# EAGLE schematic zenith (EAGLE 9.6.2)
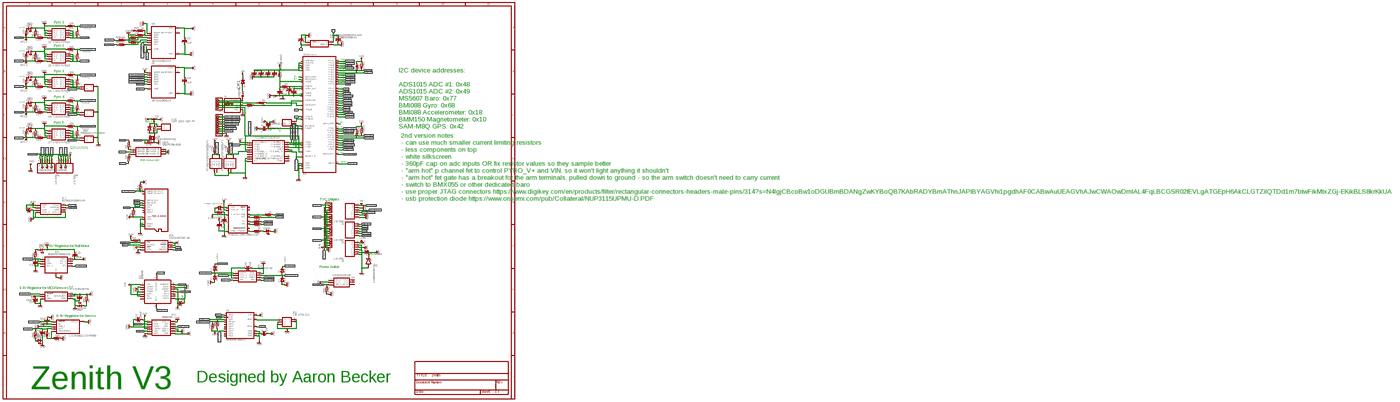
[diagram p0: schematic, sheet 1, overview]
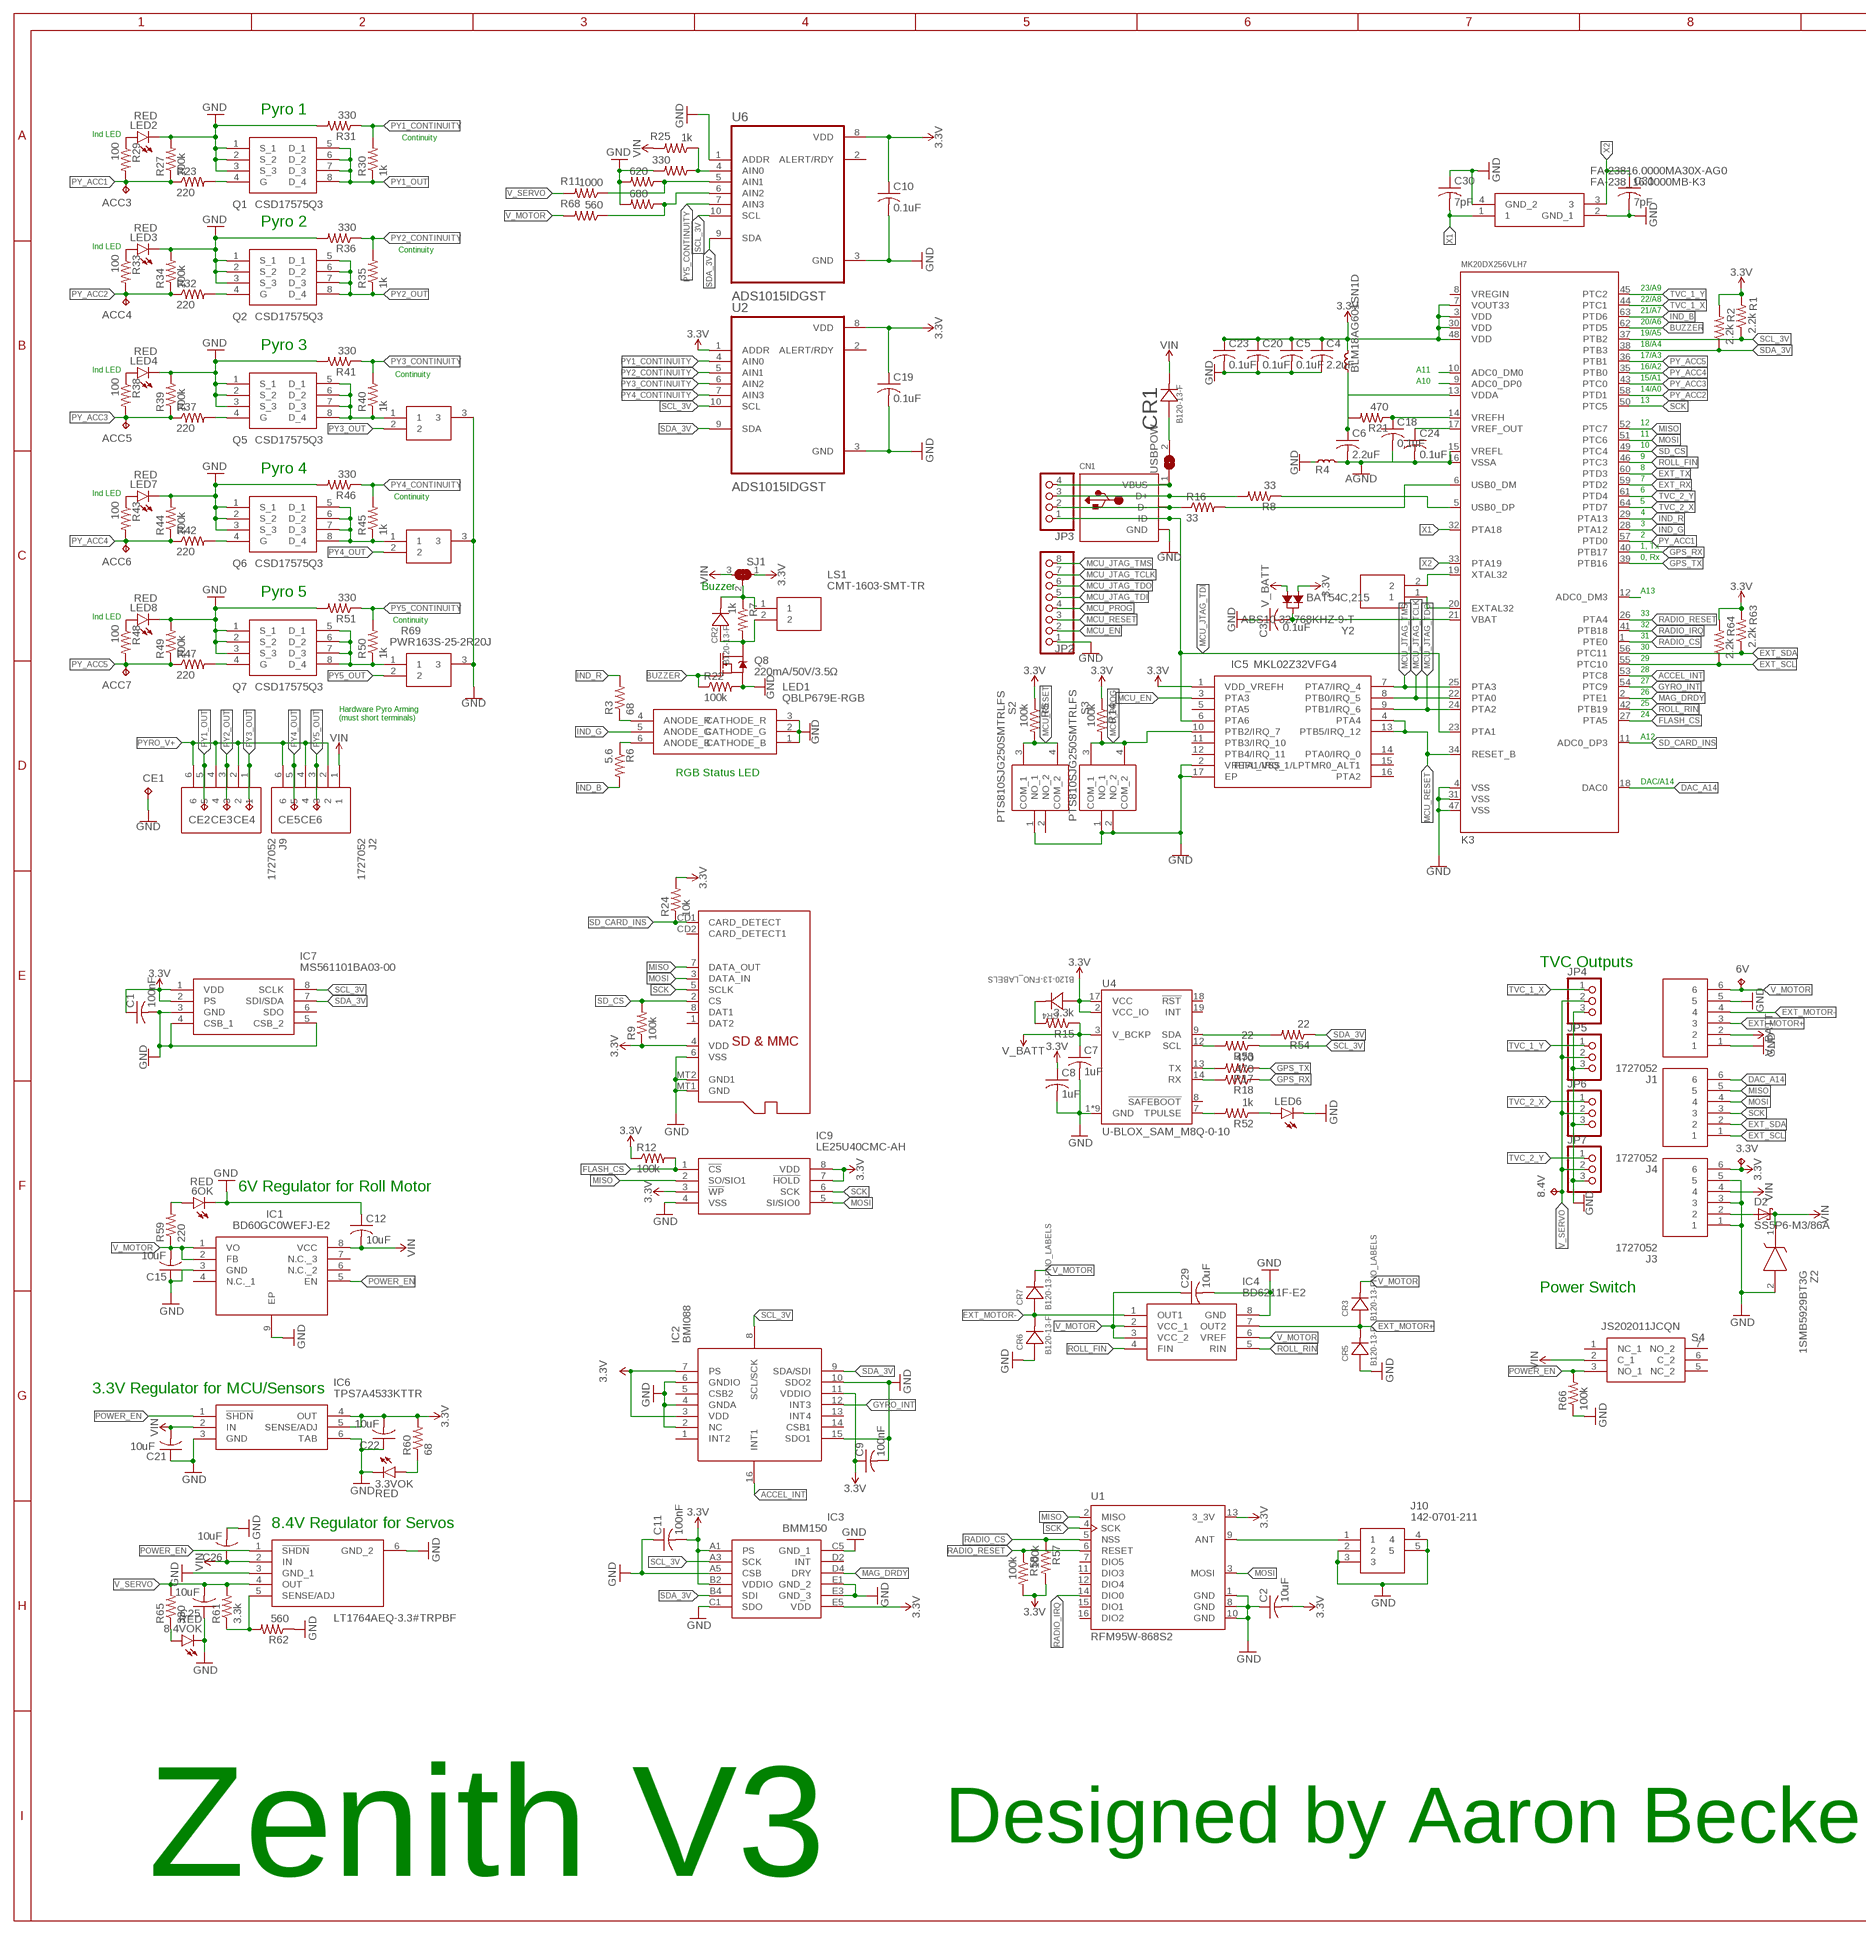
[diagram p1: schematic, sheet 1, part 1 of 4]
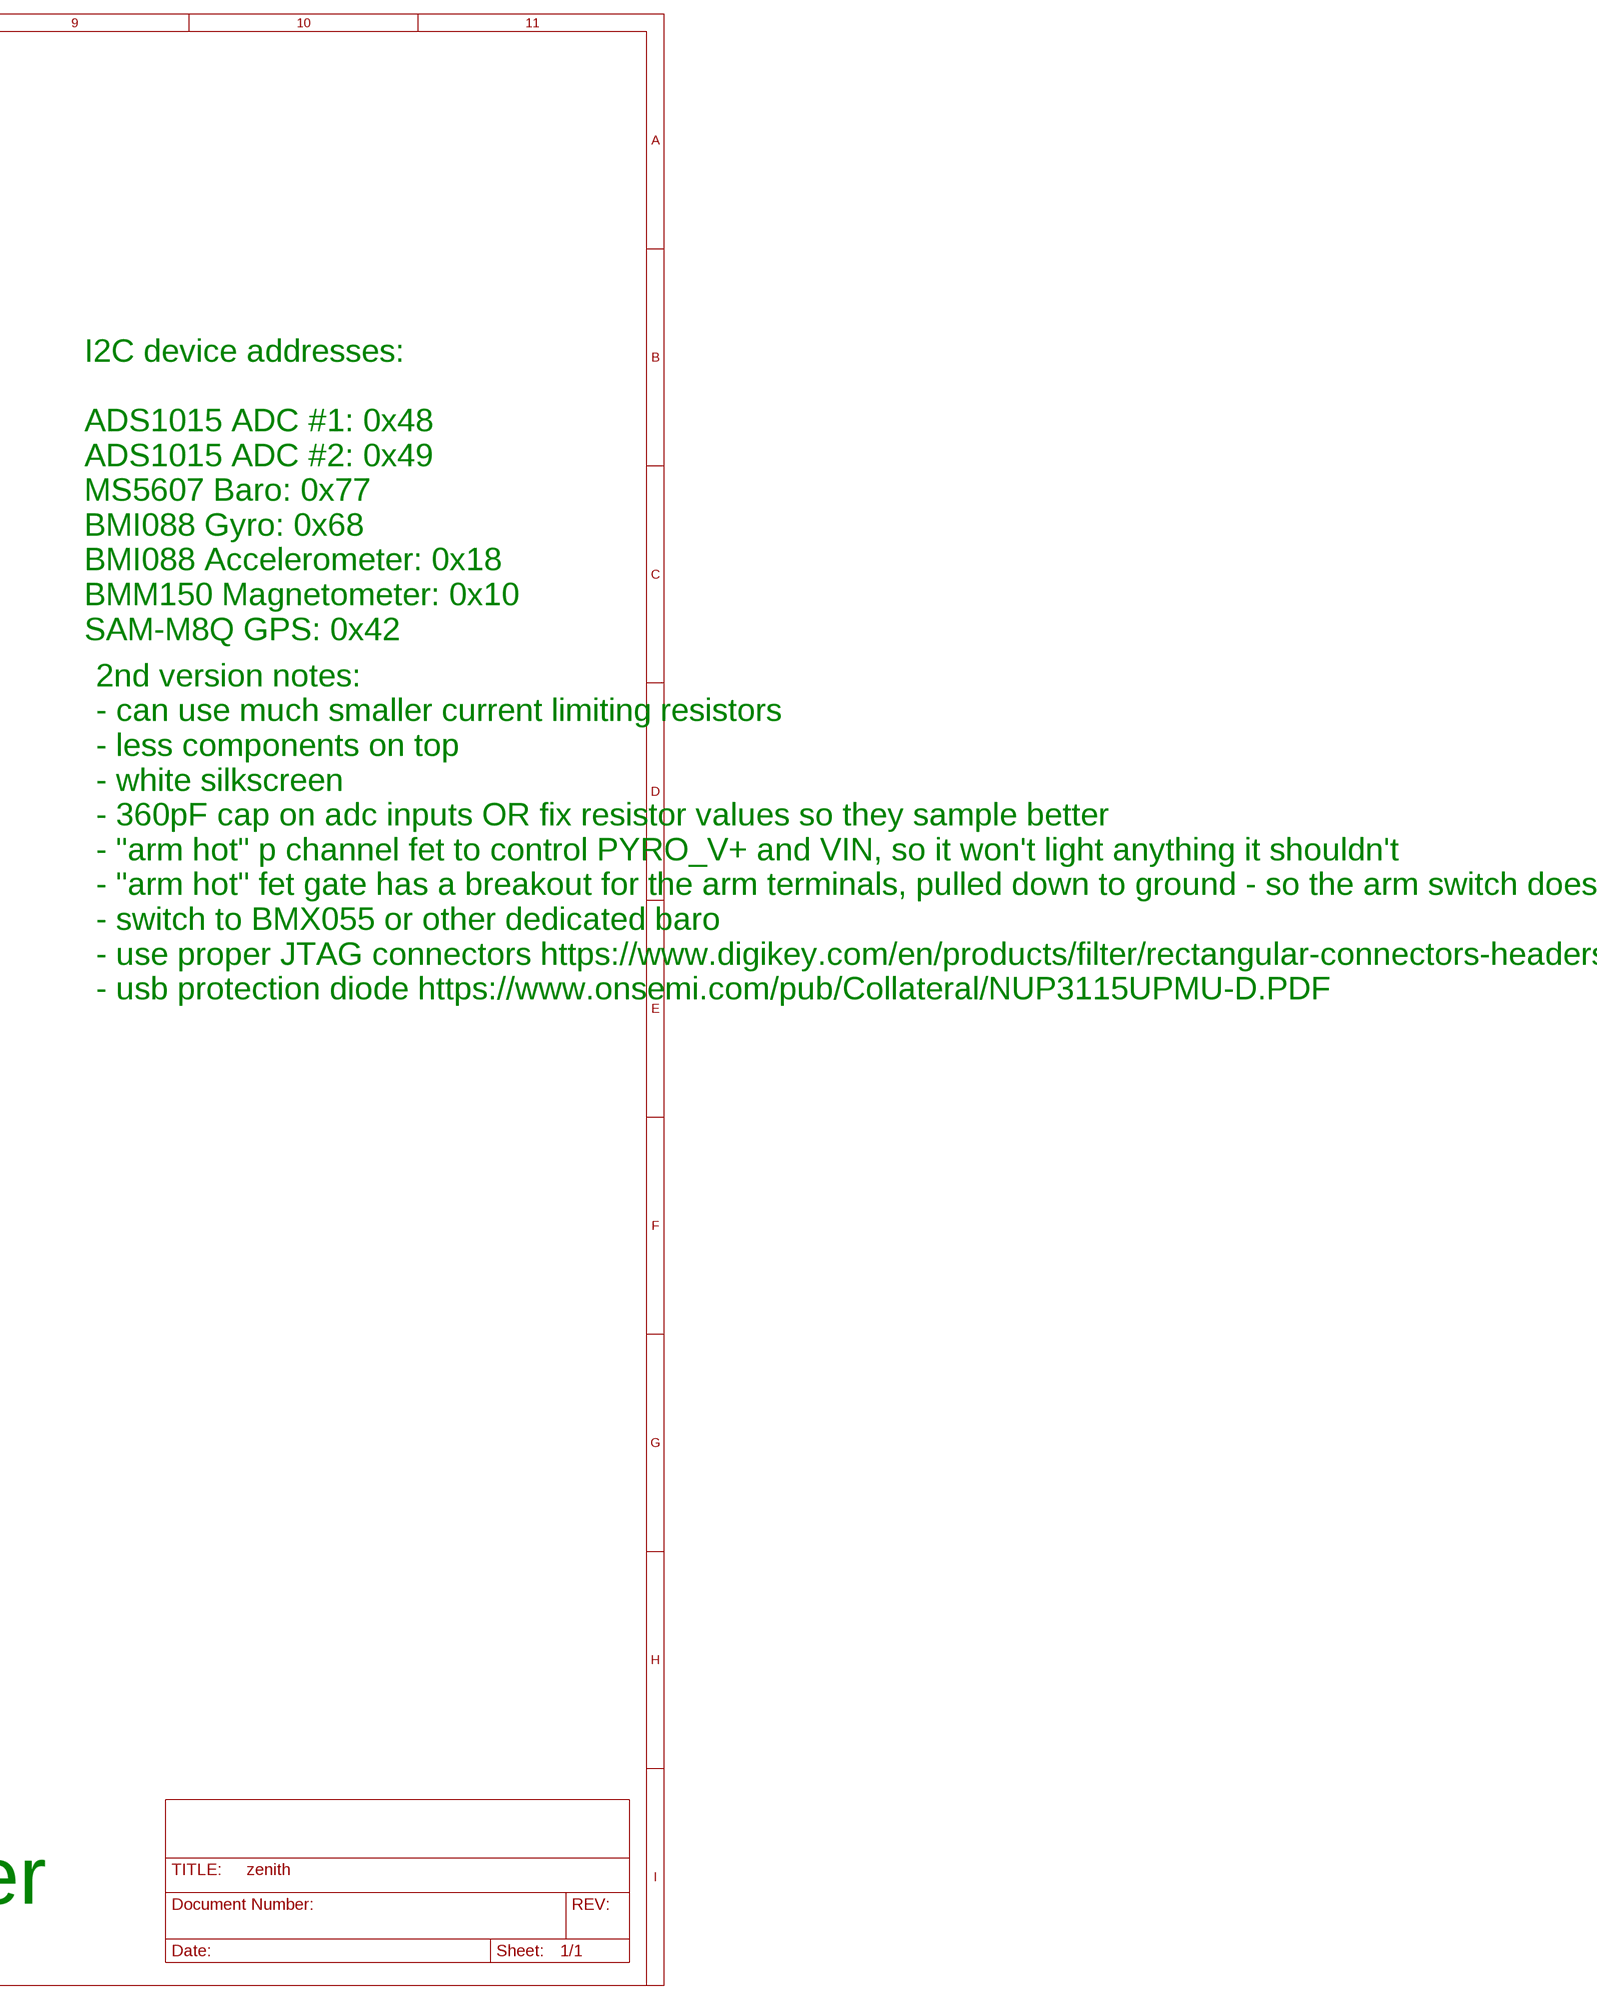
[diagram p2: schematic, sheet 1, part 2 of 4]
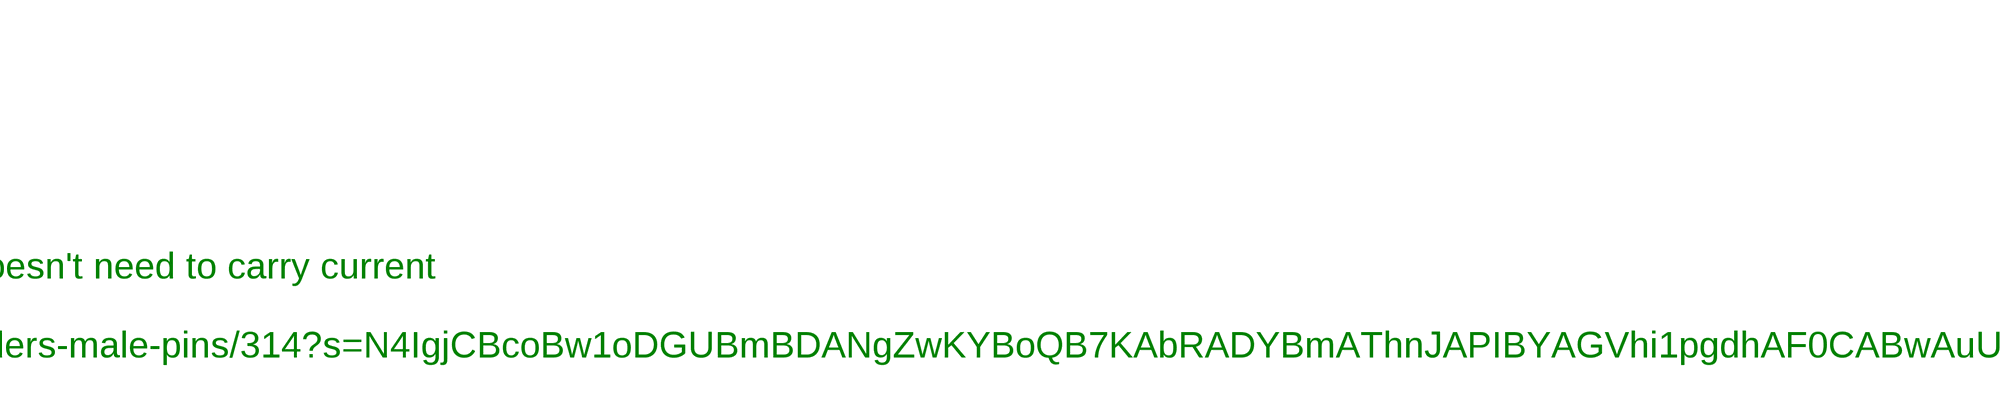
[diagram p3: schematic, sheet 1, part 3 of 4]
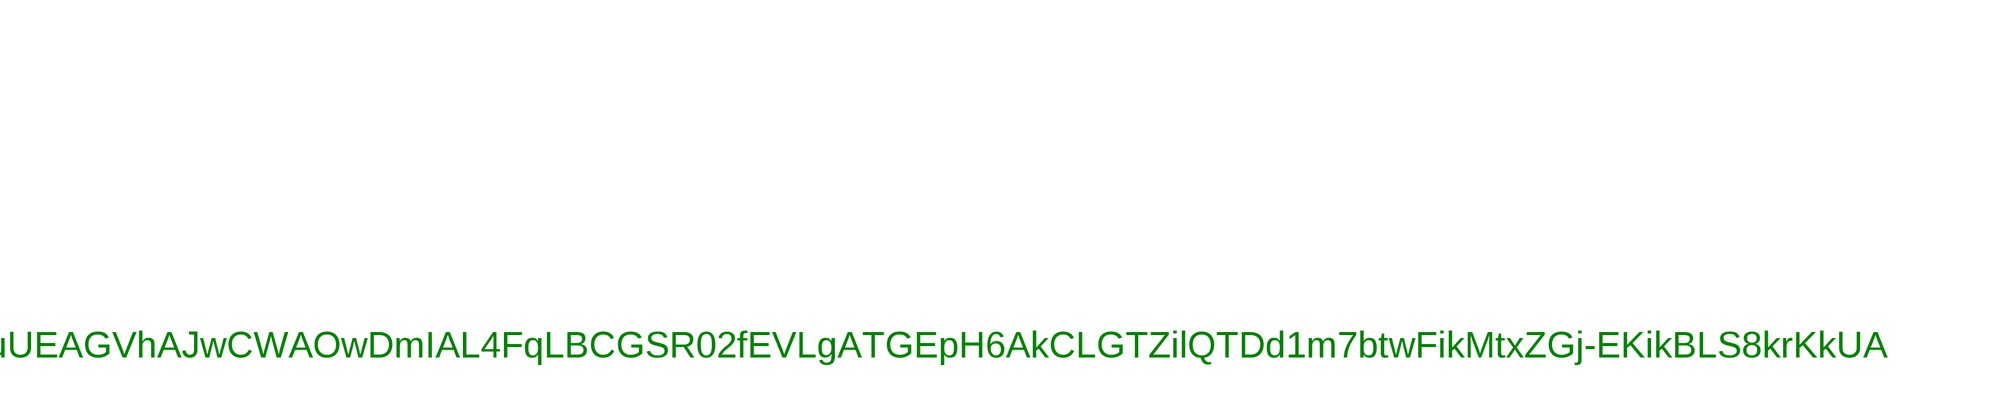
[diagram p4: schematic, sheet 1, part 4 of 4]

## Parts
3.3V  TPB1,27  [B1,27]
3.3VOK  RED  LEDCHIP-LED0805  [CHIP-LED0805]
6OK  RED  LEDCHIP-LED0805  [CHIP-LED0805]
6V  TPB1,27  [B1,27]
8.4V  TPB1,27  [B1,27]
8.4VOK  RED  LEDCHIP-LED0805  [CHIP-LED0805]
0473340001  MICROSD  [MICROSD]
ACC3  TPB1,27  [B1,27]
ACC4  TPB1,27  [B1,27]
ACC5  TPB1,27  [B1,27]
ACC6  TPB1,27  [B1,27]
ACC7  TPB1,27  [B1,27]
BAT54C,215  DIODE_DUAL  [SOT-23]
BLM18AG601SN1D  FERRITE  [L0603]
C1  100nF  C-USC0603  [C0603]
C2  10uF  C-USC0603  [C0603]
C3  0.1uF  C-USC0603  [C0603]
C4  2.2uF  C-USC0603  [C0603]
C5  0.1uF  C-USC0603  [C0603]
C6  2.2uF  C-USC0603  [C0603]
C7  1uF  C-USC0603  [C0603]
C8  1uF  C-USC0603  [C0603]
C9  100nF  C-USC0603  [C0603]
C10  0.1uF  C-USC0603  [C0603]
C11  100nF  C-USC0603  [C0603]
C12  10uF  C-USC0603  [C0603]
C15  10uF  C-USC0603  [C0603]
C18  0.1uF  C-USC0603  [C0603]
C19  0.1uF  C-USC0603  [C0603]
C20  0.1uF  C-USC0603  [C0603]
C21  10uF  C-USC0603  [C0603]
C22  10uF  C-USC0603  [C0603]
C23  0.1uF  C-USC0603  [C0603]
C24  0.1uF  C-USC0603  [C0603]
C25  10uF  C-USC0603  [C0603]
C26  10uF  C-USC0603  [C0603]
C29  10uF  C-USC0603  [C0603]
C30  7pF  C-USC0603  [C0603]
C31  7pF  C-USC0603  [C0603]
CE1  TPB1,27  [B1,27]
CE2  TPB1,27  [B1,27]
CE3  TPB1,27  [B1,27]
CE4  TPB1,27  [B1,27]
CE5  TPB1,27  [B1,27]
CE6  TPB1,27  [B1,27]
CN1  USBMINIB  [USB-MINIB]
CR1  B120-13-F  [SMA_DIO]
CR2  B120-13-F  [SMA_DIO]
CR3  B120-13-FNO_LABELS  [SMA_NO_LABELS]
CR4  B120-13-FNO_LABELS  [SMA_NO_LABELS]
CR5  B120-13-F  [SMA_DIO]
CR6  B120-13-F  [SMA_DIO]
CR7  B120-13-FNO_LABELS  [SMA_NO_LABELS]
D2  SS5P6-M3/86A  [TO-277A(SMPC)]
FA-23816.0000MA30X-AG0  FA-238_16.0000MB-K3  [EPSON-FA-238]
IC1  BD60GC0WEFJ-E2  [SOIC127P600X100-9N]
IC2  BMI088  [BMI088]
IC3  BMM150  [BMM150]
IC4  BD6211F-E2  [SOIC127P620X171-8N]
IC5  MKL02Z32VFG4  [QFN50P300X300X65-17N]
IC6  TPS7A4533KTTR  [KTT0005B]
IC7  MS561101BA03-00  [SON125P300X500X100-8N]
IC9  LE25U40CMC-AH  [SOIC127P600X175-8N]
J1  1727052  [SHDR6W105P0X381_1X6_2285X730X8]
J2  1727052  [SHDR6W105P0X381_1X6_2285X730X8]
J3  1727052  [SHDR6W105P0X381_1X6_2285X730X8]
J4  1727052  [SHDR6W105P0X381_1X6_2285X730X8]
J9  1727052  [SHDR6W105P0X381_1X6_2285X730X8]
J10  142-0701-211  [1420701211]
JP2  PINHD-1X8  [1X08]
JP3  PINHD-1X4  [1X04]
JP4  PINHD-1X3  [1X03]
JP5  PINHD-1X3  [1X03]
JP6  PINHD-1X3  [1X03]
JP7  PINHD-1X3  [1X03]
K3  MK20DX256VLH7  [LQFP64-05]
LED1  QBLP679E-RGB  [QBLP679ERGB]
LED2  RED  LEDCHIP-LED0805  [CHIP-LED0805]
LED3  RED  LEDCHIP-LED0805  [CHIP-LED0805]
LED4  RED  LEDCHIP-LED0805  [CHIP-LED0805]
LED6  LEDCHIP-LED0805  [CHIP-LED0805]
LED7  RED  LEDCHIP-LED0805  [CHIP-LED0805]
LED8  RED  LEDCHIP-LED0805  [CHIP-LED0805]
LS1  CMT-1603-SMT-TR  [CMT1603SMTTR]
LT1764#TRPBF  LT1764AEQ-3.3#TRPBF  [LT1764AEQ33TRPBF]
Q1  CSD17575Q3  [CSD16327]
Q2  CSD17575Q3  [CSD16327]
Q5  CSD17575Q3  [CSD16327]
Q6  CSD17575Q3  [CSD16327]
Q7  CSD17575Q3  [CSD16327]
Q8  220mA/50V/3.5Ω  MOSFET-NCH-BSS138  [SOT23-3]
R1  2.2k  R-US_R0603  [R0603]
R2  2.2k  R-US_R0603  [R0603]
R3  68  R-US_R0603  [R0603]
R4  FERRITE  [L0603]
R5  100k  R-US_R0603  [R0603]
R6  5.6  R-US_R0603  [R0603]
R7  1k  R-US_R0603  [R0603]
R8  33  R-US_R0603  [R0603]
R9  100k  R-US_R0603  [R0603]
R10  620  R-US_R0603  [R0603]
R11  1000  R-US_R0603  [R0603]
R12  100k  R-US_R0603  [R0603]
R14  100k  R-US_R0603  [R0603]
R15  3.3k  R-US_R0603  [R0603]
R16  33  R-US_R0603  [R0603]
R17  470  R-US_R0603  [R0603]
R18  470  R-US_R0603  [R0603]
R21  470  R-US_R0603  [R0603]
R22  100k  R-US_R0603  [R0603]
R23  220  R-US_R0603  [R0603]
R24  10k  R-US_R0603  [R0603]
R25  1k  R-US_R0603  [R0603]
R26  330  R-US_R0603  [R0603]
R27  100k  R-US_R0603  [R0603]
R28  PWR163S-25-2R20J  [PWR163_DPAK]
R29  100  R-US_R0603  [R0603]
R30  1k  R-US_R0603  [R0603]
R31  330  R-US_R0603  [R0603]
R32  220  R-US_R0603  [R0603]
R33  100  R-US_R0603  [R0603]
R34  100k  R-US_R0603  [R0603]
R35  1k  R-US_R0603  [R0603]
R36  330  R-US_R0603  [R0603]
R37  220  R-US_R0603  [R0603]
R38  100  R-US_R0603  [R0603]
R39  100k  R-US_R0603  [R0603]
R40  1k  R-US_R0603  [R0603]
R41  330  R-US_R0603  [R0603]
R42  220  R-US_R0603  [R0603]
R43  100  R-US_R0603  [R0603]
R44  100k  R-US_R0603  [R0603]
R45  1k  R-US_R0603  [R0603]
R46  330  R-US_R0603  [R0603]
R47  220  R-US_R0603  [R0603]
R48  100  R-US_R0603  [R0603]
R49  100k  R-US_R0603  [R0603]
R50  1k  R-US_R0603  [R0603]
R51  330  R-US_R0603  [R0603]
R52  1k  R-US_R0603  [R0603]
R53  22  R-US_R0603  [R0603]
R54  22  R-US_R0603  [R0603]
R55  PWR163S-25-2R20J  [PWR163_DPAK]
R57  100k  R-US_R0603  [R0603]
R58  100k  R-US_R0603  [R0603]
R59  220  R-US_R0603  [R0603]
R60  68  R-US_R0603  [R0603]
R61  3.3k  R-US_R0603  [R0603]
R62  560  R-US_R0603  [R0603]
R63  2.2k  R-US_R0603  [R0603]
R64  2.2k  R-US_R0603  [R0603]
R65  330  R-US_R0603  [R0603]
R66  100k  R-US_R0603  [R0603]
R67  680  R-US_R0603  [R0603]
R68  560  R-US_R0603  [R0603]
R69  PWR163S-25-2R20J  [PWR163_DPAK]
S2  PTS810SJG250SMTRLFS  [PTS810SJG250SMTRLFS]
S3  PTS810SJG250SMTRLFS  [PTS810SJG250SMTRLFS]
S4  JS202011JCQN  [JS202011JCQN]
SJ1  SOLDERJUMPER_2WAY0603  [SOLDERJUMPER_2WAY_OPEN_0603]
U1  RFM95W-868S2  [XCVR_RFM95W-868S2]
U2  ADS1015IDGST  [SOP50P490X110-10N]
U4  U-BLOX_SAM_M8Q-0-10  [SAM-M8Q]
U6  ADS1015IDGST  [SOP50P490X110-10N]
USBPOW  SJ  [SJ]
Y2  ABS10-32.768KHZ-9-T  [ABS-10]
Z2  1SMB5929BT3G  [DIOM5436X247N]

## Nets
3.3V [ICPower]: 3.3V.TP 0473340001.4(VDD) BAT54C,215.1 BLM18AG601SN1D.2 C1.1 C2.2 C4.1 C5.1 C8.1 C9.1 C10.1 C11.2 C19.1 C20.1 C22.2 C23.1 CR4.2 IC2.3(VDD) IC2.7(PS) IC2.11(VDDIO) IC3.A1(PS) IC3.B2(VDDIO) IC3.E5(VDD) IC5.1(VDD_VREFH) IC6.4(OUT) IC6.5(SENSE/ADJ) IC7.1(VDD) IC7.2(PS) IC9.3(!WP) IC9.7(!HOLD) IC9.8(VDD) J3.6 K3.3(VDD) K3.7(VOUT33) K3.30(VDD) K3.48(VDD) R1.2 R2.2 R5.1 R9.1 R12.1 R14.1 R24.2 R57.2 R58.2 R60.2 R63.2 R64.2 SJ1.1 U1.13(3_3V) U2.1(ADDR) U2.8(VDD) U4.2(VCC_IO) U4.17(VCC) U6.8(VDD)
ACCEL_INT: IC2.16(INT1) K3.53(PTC8)
AGND: C6.2 C18.2 C24.2 K3.15(VREFL) K3.16(VSSA) R4.2
BUZZER: K3.62(PTD5) Q8.1(G) R22.1
DAC_A14: J4.6 K3.18(DAC0)
EXT_MOTOR+ [ICPower]: CR3.2 CR5.1 IC4.7(OUT2) J1.3
EXT_MOTOR- [ICPower]: CR6.1 CR7.2 IC4.1(OUT1) J1.4
EXT_RX: K3.59(PTD2)
EXT_SCL: J4.1 K3.55(PTC10) R64.1
EXT_SDA: J4.2 K3.56(PTC11) R63.1
EXT_TX: K3.60(PTD3)
FLASH_CS: IC9.1(!CS) K3.27(PTA5) R12.2
GND [ICPower]: 3.3VOK.C 6OK.C 8.4VOK.C 0473340001.6(VSS) 0473340001.MT1(GND) 0473340001.MT2(GND1) C1.2 C2.1 C3.1 C4.2 C5.2 C7.2 C8.2 C9.2 C10.2 C11.1 C12.1 C15.1 C19.2 C20.2 C21.1 C22.1 C23.2 C25.1 C26.2 C29.2 C30.1 C31.2 CE1.TP CN1.GND CR5.2 CR6.2 FA-23816.0000MA30X-AG0.2(GND_1) FA-23816.0000MA30X-AG0.4(GND_2) IC1.3(GND) IC1.9(EP) IC2.2(NC) IC2.4(GNDA) IC2.6(GNDIO) IC2.10(SDO2) IC2.15(SDO1) IC3.A5(CSB) IC3.C1(SDO) IC3.C5(GND_1) IC3.E1(GND_2) IC3.E3(GND_3) IC4.8(GND) IC5.2(VREFL_VSS) IC5.17(EP) IC6.3(GND) IC6.6(TAB) IC7.3(GND) IC7.4(CSB_1) IC7.5(CSB_2) IC9.4(VSS) J1.1 J1.5 J3.1 J3.3 J3.5 J10.2 J10.3 J10.4 J10.5 JP2.1 JP4.3 JP5.3 JP6.3 JP7.3 K3.4(VSS) K3.31(VSS) K3.47(VSS) LED1.1(CATHODE_B) LED1.2(CATHODE_G) LED1.3(CATHODE_R) LED2.C LED3.C LED4.C LED6.C LED7.C LED8.C LT1764#TRPBF.3(GND_1) LT1764#TRPBF.6(GND_2) Q1.1(S_1) Q1.2(S_2) Q1.3(S_3) Q2.1(S_1) Q2.2(S_2) Q2.3(S_3) Q5.1(S_1) Q5.2(S_2) Q5.3(S_3) Q6.1(S_1) Q6.2(S_2) Q6.3(S_3) Q7.1(S_1) Q7.2(S_2) Q7.3(S_3) Q8.2(S) R4.1 R10.2 R22.2 R26.2 R27.2 R28.3 R31.2 R34.2 R36.2 R39.2 R41.2 R44.2 R46.2 R49.2 R51.2 R55.3 R62.1 R66.1 R67.2 R69.3 S2.1(NO_1) S3.1(NO_1) S3.2(NO_2) U1.1(GND) U1.8(GND) U1.10(GND) U2.3(GND) U4.1(GND) U4.4(GND) U4.5(GND) U4.6(GND) U4.10(GND) U4.11(GND) U4.15(GND) U4.16(GND) U4.20(GND) U6.1(ADDR) U6.3(GND) Z2.2(A)
GPS_RX: K3.40(PTB17) R18.1
GPS_TX: K3.39(PTB16) R17.1
GYRO_INT: IC2.12(INT3) K3.54(PTC9)
IND_B [SemiHighPower]: K3.63(PTD6) R6.2
IND_G [SemiHighPower]: K3.28(PTA12) LED1.5(ANODE_G)
IND_R [SemiHighPower]: K3.29(PTA13) R3.2
MAG_DRDY: IC3.D4(DRY) K3.2(PTE1)
MCU_EN: IC5.3(PTA3) JP2.2
MCU_JTAG_TCLK: IC5.8(PTB0/IRQ_5) JP2.7 K3.22(PTA0)
MCU_JTAG_TDI: CN1.ID IC5.6(PTA6) JP2.5 JP3.1 K3.23(PTA1)
MCU_JTAG_TDO: IC5.9(PTB1/IRQ_6) JP2.6 K3.24(PTA2)
MCU_JTAG_TMS: IC5.7(PTA7/IRQ_4) JP2.8 K3.25(PTA3)
MCU_PROG: IC5.10(PTB2/IRQ_7) JP2.4 R14.2 S3.3(COM_1) S3.4(COM_2)
MCU_RESET: IC5.4(PTA4) IC5.13(PTB5/IRQ_12) JP2.3 K3.34(RESET_B) R5.2 S2.3(COM_1) S2.4(COM_2)
MISO: 0473340001.7(DATA_OUT) IC9.2(SO/SIO1) J4.5 K3.52(PTC7) U1.2(MISO)
MOSI: 0473340001.3(DATA_IN) IC9.5(SI/SIO0) J4.4 K3.51(PTC6) U1.3(MOSI)
N$1: BAT54C,215.3 C3.2 K3.21(VBAT)
N$2 [SemiHighPower]: LED1.4(ANODE_R) R3.1
N$3: K3.19(XTAL32) Y2.2
N$4: BLM18AG601SN1D.1 C6.1 R21.2
N$5: R10.1 R11.1 U6.5(AIN1)
N$6 [SemiHighPower]: LED1.6(ANODE_B) R6.1
N$7: CR2.2 LS1.2 Q8.3(D) R7.2
N$8: J10.1 U1.9(ANT)
N$9 [Pyro]: Q7.5(D_1) Q7.6(D_2) Q7.7(D_3) Q7.8(D_4) R50.1 R69.1
N$10: C24.1 K3.17(VREF_OUT)
N$11: 3.3VOK.A R60.1
N$12: CR4.1 R15.2
N$14: 6OK.A R59.2
N$15: R17.2 U4.13(TX)
N$16: R18.2 U4.14(RX)
N$17: LED6.A R52.1
N$18: R52.2 U4.7(TPULSE)
N$19: 8.4VOK.A R65.1
N$20: R25.1 R26.1 U6.4(AIN0)
N$21: CN1.D+ JP3.3 R8.2
N$22: CN1.D- JP3.2 R16.1
N$23: K3.5(USB0_DP) R8.1
N$24: K3.6(USB0_DM) R16.2
N$25: CR1.2 USBPOW.2
N$26 [Pyro]: Q6.5(D_1) Q6.6(D_2) Q6.7(D_3) Q6.8(D_4) R28.1 R45.1
N$27: CN1.VBUS JP3.4 USBPOW.1
N$29: K3.13(VDDA)
N$30: C18.1 K3.14(VREFH) R21.1
N$31: R54.2 U4.9(SDA)
N$32: R53.2 U4.12(SCL)
N$33: LT1764#TRPBF.5(SENSE/ADJ) R61.1 R62.2
N$34: R67.1 R68.1 U6.6(AIN2)
N$35: CR2.1 LS1.1 R7.1 SJ1.2
N$36 [Pyro]: D2.A1(A) D2.A2(A) J3.2
N$37: K3.20(EXTAL32) Y2.1
N$39 [Pyro]: Q5.5(D_1) Q5.6(D_2) Q5.7(D_3) Q5.8(D_4) R40.1 R55.1
N$81: Q1.4(G) R23.2
N$82: LED2.A R29.1
N$86: Q2.4(G) R32.2
N$88: LED3.A R33.1
N$92: Q5.4(G) R37.2
N$94: LED4.A R38.1
N$98: Q6.4(G) R42.2
N$100: LED7.A R43.1
N$104: Q7.4(G) R47.2
N$106: LED8.A R48.1
N$117: K3.12(ADC0_DM3)
N$129: K3.10(ADC0_DM0)
N$130: K3.9(ADC0_DP0)
POWER_EN: IC1.5(EN) IC6.1(!SHDN) LT1764#TRPBF.1(!SHDN) R66.2 S4.3(NO_1)
PY1_CONTINUITY: R30.2 R31.1 U2.4(AIN0)
PY1_OUT [Pyro]: CE2.TP J9.5 Q1.5(D_1) Q1.6(D_2) Q1.7(D_3) Q1.8(D_4) R30.1
PY2_CONTINUITY: R35.2 R36.1 U2.5(AIN1)
PY2_OUT [Pyro]: CE3.TP J9.3 Q2.5(D_1) Q2.6(D_2) Q2.7(D_3) Q2.8(D_4) R35.1
PY3_CONTINUITY: R40.2 R41.1 U2.6(AIN2)
PY3_OUT [Pyro]: CE4.TP J9.1 R55.2
PY4_CONTINUITY: R45.2 R46.1 U2.7(AIN3)
PY4_OUT [Pyro]: CE5.TP J2.5 R28.2
PY5_CONTINUITY: R50.2 R51.1 U6.7(AIN3)
PY5_OUT [Pyro]: CE6.TP J2.3 R69.2
PY_ACC1: ACC3.TP K3.57(PTD0) R23.1 R27.1 R29.2
PY_ACC2: ACC4.TP K3.58(PTD1) R32.1 R33.2 R34.1
PY_ACC3: ACC5.TP K3.43(PTC0) R37.1 R38.2 R39.1
PY_ACC4: ACC6.TP K3.35(PTB0) R42.1 R43.2 R44.1
PY_ACC5: ACC7.TP K3.36(PTB1) R47.1 R48.2 R49.1
PYRO_V+ [Pyro]: J2.2 J2.4 J2.6 J9.2 J9.4 J9.6
RADIO_CS: K3.1(PTE0) R57.1 U1.5(NSS)
RADIO_IRQ: K3.41(PTB18) U1.14(DIO0)
RADIO_RESET: K3.26(PTA4) R58.1 U1.6(RESET)
ROLL_FIN: IC4.4(FIN) K3.46(PTC3)
ROLL_RIN: IC4.5(RIN) K3.42(PTB19)
SCK: 0473340001.5(SCLK) IC9.6(SCK) J4.3 K3.50(PTC5) U1.4(SCK)
SCL_3V: IC2.8(SCL/SCK) IC3.A3(SCK) IC7.8(SCLK) K3.37(PTB2) R1.1 R53.1 U2.10(SCL) U6.10(SCL)
SD_CARD_INS: 0473340001.CD1(CARD_DETECT) K3.11(ADC0_DP3) R24.1
SD_CS: 0473340001.2(CS) K3.49(PTC4) R9.2
SDA_3V: IC2.9(SDA/SDI) IC3.B4(SDI) IC7.7(SDI/SDA) K3.38(PTB3) R2.1 R54.1 U2.9(SDA) U6.9(SDA)
TVC_1_X: JP4.1 K3.44(PTC1)
TVC_1_Y: JP5.1 K3.45(PTC2)
TVC_2_X: JP6.1 K3.64(PTD7)
TVC_2_Y: JP7.1 K3.61(PTD4)
V_BATT: BAT54C,215.2 C7.1 J1.2 R15.1 U4.3(V_BCKP)
V_MOTOR [HighPower]: 6V.TP C15.2 C29.1 CR3.1 CR7.1 IC1.1(VO) IC1.2(FB) IC4.2(VCC_1) IC4.3(VCC_2) IC4.6(VREF) J1.6 R59.1 R68.2
V_SERVO [HighPower]: 8.4V.TP C25.2 JP4.2 JP5.2 JP6.2 JP7.2 LT1764#TRPBF.4(OUT) R11.2 R61.2 R65.2
VIN [Pyro]: C12.2 C21.2 C26.1 CR1.1 D2.K(C) IC1.8(VCC) IC6.2(IN) J2.1 J3.4 LT1764#TRPBF.2(IN) R25.2 S4.2(C_1) SJ1.3 Z2.1(K)
X1: C30.2 FA-23816.0000MA30X-AG0.1 K3.32(PTA18)
X2: C31.1 FA-23816.0000MA30X-AG0.3 K3.33(PTA19)
Unconnected: 0473340001.1(DAT2) 0473340001.8(DAT1) 0473340001.CD2(CARD_DETECT1) IC1.4(N.C._1) IC1.6(N.C._2) IC1.7(N.C._3) IC2.1(INT2) IC2.5(CSB2) IC2.13(INT4) IC2.14(CSB1) IC3.D2(INT) IC5.5(PTA5) IC5.11(PTB3/IRQ_10) IC5.12(PTB4/IRQ_11) IC5.14(PTA0/IRQ_0) IC5.15(PTA1/IRQ_1/LPTMR0_ALT1) IC5.16(PTA2) IC7.6(SDO) K3.8(VREGIN) S2.2(NO_2) S4.1(NC_1) S4.5(NC_2) S4.6(C_2) S4.7(NO_2) U1.7(DIO5) U1.11(DIO3) U1.12(DIO4) U1.15(DIO1) U1.16(DIO2) U2.2(ALERT/RDY) U4.8(!SAFEBOOT) U4.18(!RST) U4.19(INT) U6.2(ALERT/RDY)

## Notes on the sheet
- Pyro 1
- Ind LED
- Continuity
- Pyro 2
- Ind LED
- Continuity
- 23/A9
- 22/A8
- 21/A7
- 20/A6
- 19/A5
- 18/A4
- Pyro 3
- 17/A3
- 16/A2
- Ind LED | A11
- Continuity
- 15/A1
- A10
- 14/A0
- 13
- 12
- 11
- 10
- 9
- 8
- Pyro 4
- 7
- 6
- Ind LED
- Continuity
- 5
- 4
- 3
- 2
- 1, Tx
- 0, Rx
- Buzzer
- A13
- Pyro 5
- 33
- Ind LED
- I2C device addresses:
  
  ADS1015 ADC #1: 0x48
  ADS1015 ADC #2: 0x49
  MS5607 Baro: 0x77
  BMI088 Gyro: 0x68
  BMI088 Accelerometer: 0x18
  BMM150 Magnetometer: 0x10
  SAM-M8Q GPS: 0x42
- Continuity
- 32
- 31
- 30
- 29
- 28
- 27
- 26
- 25
- 24
- Hardware Pyro Arming
  (must short terminals)
- A12
- RGB Status LED
- DAC/A14
- TVC Outputs
- 2nd version notes:
  - can use much smaller current limiting resistors
  - less components on top
  - white silkscreen
  - 360pF cap on adc inputs OR fix resistor values so they sample better
  - "arm hot" p channel fet to control PYRO_V+ and VIN, so it won't light anything it shouldn't
  - "arm hot" fet gate has a breakout for the arm terminals, pulled down to ground - so the arm switch doesn't need to carry current
  - switch to BMX055 or other dedicated baro
  - use proper JTAG connectors https://www.digikey.com/en/products/filter/rectangular-connectors-headers-male-pins/314?s=N4IgjCBcoBw1oDGUBmBDANgZwKYBoQB7KAbRADYBmAThnJAPIBYAGVhi1pgdhAF0CABwAuUEAGVhAJwCWAOwDmIAL4FqLBCGSR02fEVLgATGEpH6AkCLGTZilQTDd1m7btwFikMtxZGj-EKikBLS8krKkUA
  - usb protection diode https://www.onsemi.com/pub/Collateral/NUP3115UPMU-D.PDF
- 6V Regulator for Roll Motor
- Power Switch
- 3.3V Regulator for MCU/Sensors
- 8.4V Regulator for Servos
- Designed by Aaron Becker
- Zenith V3

## Library data of the parts
3.3V 6V 8.4V ACC3-ACC7 CE1-CE6 = testpad:TP: Test pad
3.3VOK 6OK 8.4VOK LED2-LED4 LED6-LED8 = led:LED: LED OSRAM: - CHIPLED LG R971, LG N971, LY N971, LG Q971, LY Q971, LO R971, LY R971 LH N974, LH R974 LS Q976, LO Q976, LY Q976 LO Q996 - Hyper CHIPLED LW Q18S LB Q993, LB Q99A, LB R99A - SideLED LS A670, LO A670, LY A670, LG A670, LP A670 LB A673, LV A673, LT A673, LW A673 LH A674 LY A675 LS A676, LA A676, LO A676, LY A676, LW A676 LS A679, LY A679, LG A679 - Hyper Micro SIDELED® LS Y876, LA Y876, LO Y876, LY Y876 LT Y87S - SmartLED LW L88C, LW L88S LB L89C, LB L89S, LG L890 LS L89K, LO L89K, LY L89K LS L896, LA L896, LO L896, LY L896 - TOPLED LS T670, LO T670, LY T670, LG T670, LP T670 LSG T670, LSP T670, LSY T670, LOP T670, LYG T670 LG T671, LOG T671, LSG T671 LB T673, LV T673, LT T673, LW T673 LH T674 LS T676, LA T676, LO T676, LY T676, LB T676, LH T676, LSB T676, LW T676 LB T67C, LV T67C, LT T67C, LS T67K, LO T67K, LY T67K, LW E67C LS E67B, LA E67B, LO E67B, LY E67B, LB E67C, LV E67C, LT E67C LW T67C LS T679, LY T679, LG T679 LS T770, LO T770, LY T770, LG T770, LP T770 LB T773, LV T773, LT T773, LW T773 LH T774 LS E675, LA E675, LY E675, LS T675 LS T776, LA T776, LO T776, LY T776, LB T776 LHGB T686 LT T68C, LB T68C - Hyper Mini TOPLED® LB M676 - Mini TOPLED Santana® LG M470 LS M47K, LO M47K, LY M47K Source: http://www.osram.convergy.de LUXEON: - LUMILED® LXK2-PW12-R00, LXK2-PW12-S00, LXK2-PW14-U00, LXK2-PW14-V00 LXK2-PM12-R00, LXK2-PM12-S00, LXK2-PM14-U00 LXK2-PE12-Q00, LXK2-PE12-R00, LXK2-PE12-S00, LXK2-PE14-T00, LXK2-PE14-U00 LXK2-PB12-K00, LXK2-PB12-L00, LXK2-PB12-M00, LXK2-PB14-N00, LXK2-PB14-P00, LXK2-PB14-Q00 LXK2-PR12-L00, LXK2-PR12-M00, LXK2-PR14-Q00, LXK2-PR14-R00 LXK2-PD12-Q00, LXK2-PD12-R00, LXK2-PD12-S00 LXK2-PH12-R00, LXK2-PH12-S00 LXK2-PL12-P00, LXK2-PL12-Q00, LXK2-PL12-R00 Source: www.luxeon.com KINGBRIGHT: KA-3528ASYC Source: www.kingbright.com
0473340001 = adafruit:MICROSD: Micro-SD / Transflash card holder with SPI pinout For the 3M # 2908-05WB-MG and/or 4UCON #19656 push-push type
BAT54C,215 = t32_ref:DIODE_DUAL; DESC: Dual Schottky, common cat; MF: NXP Semiconductors; MPN: BAT54C,215; OC_MOUSER: 771-BAT54C-T/R; PACKAGE: SOT-23; TYPE: Diode
BLM18AG601SN1D R4 = t32_ref:FERRITE; DESC: 600R / 100MHz; MF: Murata Electronics; MPN: BLM18AG601SN1D; OC_MOUSER: 81-BLM11A601S; PACKAGE: 0603; TYPE: Ferrite
C1-C12 C15 C18-C26 C29-C31 = rcl:C-US: CAPACITOR, American symbol; SPICEPREFIX: C
CN1 = adafruit:USB: USB Connectors USBMINIB - Surface Mount Female Mini-B USB Connector 4UConnector: 06564 By microbuilder.eu Thru-hole RA Female Mini-B USB Connector 4UConnector: 18732 By ladyada.net
CR1 CR2 CR5 CR6 = B120-13-F:B120-13-F; BUILT_BY: EMA_UL_Team; MANUFACTURER_PART_NUMBER: B120-13-F; SOURCELIBRARY: DiodesInc_2015-05-08; VENDOR: Diodes Inc
CR3 CR4 CR7 = B120-13-F:B120-13-F
D2 = SS5P6-M3_86A:SS5P6-M3/86A: Vishay SS5P6-M3/86A 60V 5A; ARROW_ELECTRONICS-PURCHASE-URL: https://snapeda.com/shop?store=Arrow+Electronics&id=580592; AVAILABILITY: Unavailable; DESCRIPTION: Diode Schottky 60V 5A Surface Mount TO-277A (SMPC); DIGIKEY-PURCHASE-URL: https://snapeda.com/shop?store=DigiKey&id=580592; MF: Vishay Semiconductor; MOUSER-PURCHASE-URL: https://snapeda.com/shop?store=Mouser&id=580592; MP: SS5P6-M3/86A; PACKAGE: TO-277 Vishay Semiconductor; PRICE: None
FA-23816.0000MA30X-AG0 = SamacSys_Parts:FA-238_16.0000MB-K3: Crystal 16MHz Source: Datasheet <https://support.epson.biz/td/api/doc_check.php?dl=brief_fa-238v_en.pdf>; ARROW_PART_NUMBER: FA-238 16.0000MB-K3; ARROW_PRICE-STOCK: https://www.arrow.com/en/products/fa-23816.0000mb-k3/epson-electronics-america; DESCRIPTION: Crystal 16MHz; HEIGHT: mm; MANUFACTURER_NAME: Epson Timing; MANUFACTURER_PART_NUMBER: FA-238 16.0000MB-K3; MOUSER_PART_NUMBER: 732-FA238-16B-K3; MOUSER_PRICE-STOCK: https://www.mouser.co.uk/ProductDetail/Epson-Timing/FA-238-160000MB-K3?qs=CANAagUtPAoF3w0fRAI0xg%3D%3D
IC1 = SamacSys_Parts:BD60GC0WEFJ-E2: LDO Regulator 6V 1% 1A 4.5-14V HTSOP8 Source: Datasheet <http://rohmfs.rohm.com/en/products/databook/catalog/common/sf/SFC2018_E_AllPage.pdf>; ARROW_PART_NUMBER: BD60GC0WEFJ-E2; DESCRIPTION: LDO Regulator 6V 1% 1A 4.5-14V HTSOP8; HEIGHT: 1mm; MANUFACTURER_NAME: ROHM Semiconductor; MANUFACTURER_PART_NUMBER: BD60GC0WEFJ-E2; MOUSER_PART_NUMBER: 755-BD60GC0WEFJ-E2; MOUSER_PRICE-STOCK: https://www.mouser.co.uk/ProductDetail/ROHM-Semiconductor/BD60GC0WEFJ-E2?qs=QbAZ1slfEbRabsfnpcxbEg%3D%3D
IC2 = SamacSys_Parts:BMI088: Inertial Measurement Unit Digital Output 2.5V/3.3V Automotive Source: Datasheet <https://ae-bst.resource.bosch.com/media/_tech/media/datasheets/BST-BMI088-DS001-13.pdf>; ARROW_PART_NUMBER: BMI088; ARROW_PRICE-STOCK: https://www.arrow.com/en/products/bmi088/bosch; DESCRIPTION: Inertial Measurement Unit Digital Output 2.5V/3.3V Automotive; HEIGHT: 1.45mm; MANUFACTURER_NAME: Bosch Sensortec; MANUFACTURER_PART_NUMBER: BMI088; MOUSER_PART_NUMBER: 262-BMI088; MOUSER_PRICE-STOCK: https://www.mouser.co.uk/ProductDetail/Bosch-Sensortec/BMI088?qs=f9yNj16SXrIMFspTV6RB6Q%3D%3D
IC3 = SamacSys_Parts:BMM150: Board Mount Hall Effect / Magnetic Sensors 3-Axis 1.56x1.56mm WLCSP-12 Geomagnetic Source: Datasheet <https://www.arrow.com/en/products/bmm150/bosch>; ARROW_PART_NUMBER: BMM150; ARROW_PRICE-STOCK: https://www.arrow.com/en/products/bmm150/bosch; DESCRIPTION: Board Mount Hall Effect / Magnetic Sensors 3-Axis 1.56x1.56mm WLCSP-12 Geomagnetic; HEIGHT: 0.6mm; MANUFACTURER_NAME: Bosch Sensortec; MANUFACTURER_PART_NUMBER: BMM150; MOUSER_PART_NUMBER: 262-BMM150; MOUSER_PRICE-STOCK: https://www.mouser.co.uk/ProductDetail/Bosch-Sensortec/BMM150?qs=d72FGnIDsgTOmKpCEe6mYw%3D%3D
IC4 = SamacSys_Parts:BD6211F-E2: ROHM BD6211F-E2, Full Bridge Motor Driver Half-Bridge,, 8-Pin SOP Source: Datasheet <http://docs-emea.rs-online.com/webdocs/13d1/0900766b813d1ab0.pdf>; ARROW_PART_NUMBER: BD6211F-E2; ARROW_PRICE-STOCK: https://www.arrow.com/en/products/bd6211f-e2/rohm-semiconductor; DESCRIPTION: ROHM BD6211F-E2, Full Bridge Motor Driver Half-Bridge,, 8-Pin SOP; HEIGHT: 1.71mm; MANUFACTURER_NAME: ROHM Semiconductor; MANUFACTURER_PART_NUMBER: BD6211F-E2; MOUSER_PART_NUMBER: 755-BD6211F-E2; MOUSER_PRICE-STOCK: https://www.mouser.co.uk/ProductDetail/ROHM-Semiconductor/BD6211F-E2?qs=WqWCsLCZBkoJxAu8uKdYEg%3D%3D
IC5 = SamacSys_Parts:MKL02Z32VFG4: NXP MKL02Z32VFG4, 32bit ARM Cortex M0 Microcontroller, 48MHz, 32 kB Flash, 16-Pin QFN Source: Datasheet <http://www.nxp.com/docs/en/data-sheet/KL02P32M48SF0.pdf>; ARROW_PART_NUMBER: MKL02Z32VFG4; ARROW_PRICE-STOCK: https://www.arrow.com/en/products/mkl02z32vfg4/nxp-semiconductors; DESCRIPTION: NXP MKL02Z32VFG4, 32bit ARM Cortex M0 Microcontroller, 48MHz, 32 kB Flash, 16-Pin QFN; HEIGHT: 0.65mm; MANUFACTURER_NAME: NXP; MANUFACTURER_PART_NUMBER: MKL02Z32VFG4; MOUSER_PART_NUMBER: 841-MKL02Z32VFG4; MOUSER_PRICE-STOCK: https://www.mouser.co.uk/ProductDetail/NXP-Semiconductors/MKL02Z32VFG4?qs=RECgZY%252BK1xLpPFD7GzHxWg%3D%3D
IC6 = SamacSys_Parts:TPS7A4533KTTR: Low-Noise Fast-Transient-Response 1.5-A Low-Dropout Voltage Regulators Source: Datasheet <http://www.ti.com/lit/gpn/tps7a45>; ARROW_PART_NUMBER: TPS7A4533KTTR; ARROW_PRICE-STOCK: https://www.arrow.com/en/products/tps7a4533kttr/texas-instruments; DESCRIPTION: Low-Noise Fast-Transient-Response 1.5-A Low-Dropout Voltage Regulators; HEIGHT: mm; MANUFACTURER_NAME: Texas Instruments; MANUFACTURER_PART_NUMBER: TPS7A4533KTTR; MOUSER_PART_NUMBER: 595-TPS7A4533KTTR; MOUSER_PRICE-STOCK: https://www.mouser.co.uk/ProductDetail/Texas-Instruments/TPS7A4533KTTR?qs=VdEABdpqjWy1AK9ieQmsYg%3D%3D
IC7 = SamacSys_Parts:MS561101BA03-00: MS561101BA03-50, Barometric Pressure Sensor, 1200mbar 0 3.6 V Output, 8-Pin QFN Source: Datasheet <http://www.amsys.info/sheets/amsys.en.ms5611_01ba03.pdf>; ARROW_PART_NUMBER: MS561101BA03-00; ARROW_PRICE-STOCK: https://www.arrow.com/en/products/ms561101ba03-00/te-connectivity; DESCRIPTION: MS561101BA03-50, Barometric Pressure Sensor, 1200mbar 0 3.6 V Output, 8-Pin QFN; HEIGHT: 1mm; MANUFACTURER_NAME: TE Connectivity; MANUFACTURER_PART_NUMBER: MS561101BA03-00; MOUSER_PART_NUMBER: 824-MS561101BA03-00; MOUSER_PRICE-STOCK: https://www.mouser.com/Search/Refine.aspx?Keyword=824-MS561101BA03-00
IC9 = SamacSys_Parts:LE25U40CMC-AH: Source: Datasheet <http://www.onsemi.com/pub/Collateral/ENA2098-D.PDF>; ARROW_PART_NUMBER: LE25U40CMC-AH; ARROW_PRICE-STOCK: https://www.arrow.com/en/products/le25u40cmc-ah/on-semiconductor; HEIGHT: 1.75mm; MANUFACTURER_NAME: ON Semiconductor; MANUFACTURER_PART_NUMBER: LE25U40CMC-AH; MOUSER_PART_NUMBER: 863-LE25U40CMC-AH; MOUSER_PRICE-STOCK: https://www.mouser.co.uk/ProductDetail/ON-Semiconductor/LE25U40CMC-AH?qs=5C9Q4QJFsuOaZKXg58P8RA%3D%3D
J1-J4 J9 = SamacSys_Parts:1727052: PHOENIX CONTACT - 1727052 - TERMINAL BLOCK, WIRE TO BRD, 6POS, 16AWG Source: Datasheet <https://www.phoenixcontact.com/online/portal/gb/?uri=pxc-oc-itemdetail:pid=1727052&library=gben&pcck=P-11-01-05&tab=1&selectedCategory=ALL>; ARROW_PART_NUMBER: 1727052; ARROW_PRICE-STOCK: https://www.arrow.com/en/products/1727052/phoenix-contact; DESCRIPTION: PHOENIX CONTACT - 1727052 - TERMINAL BLOCK, WIRE TO BRD, 6POS, 16AWG; HEIGHT: 8.65mm; MANUFACTURER_NAME: Phoenix Contact; MANUFACTURER_PART_NUMBER: 1727052; MOUSER_PART_NUMBER: 651-1727052; MOUSER_PRICE-STOCK: https://www.mouser.co.uk/ProductDetail/Phoenix-Contact/1727052?qs=WWq3Ki8dym7VpMyTMk0i8A%3D%3D
J10 = SamacSys_Parts:142-0701-211: Cinch Connectors Straight 50 PCB Mount SMA Connector, jack, Solder Termination Source: Datasheet <https://media.digikey.com/pdf/Data Sheets/Emerson PDFs/142-0701-211, 216, 217.pdf>; ARROW_PART_NUMBER: 142-0701-211; ARROW_PRICE-STOCK: https://www.arrow.com/en/products/142-0701-211/cinch-connectivity-solutions; DESCRIPTION: Cinch Connectors Straight 50 PCB Mount SMA Connector, jack, Solder Termination; HEIGHT: 9.652mm; MANUFACTURER_NAME: Cinch Connectivity Solutions; MANUFACTURER_PART_NUMBER: 142-0701-211; MOUSER_PART_NUMBER: 530-1420701211; MOUSER_PRICE-STOCK: https://www.mouser.co.uk/ProductDetail/Johnson-Cinch-Connectivity-Solutions/142-0701-211?qs=VqHsQWpF6ulG8WyKOf%2FLqg%3D%3D
JP2 = pinhead:PINHD-1X8: PIN HEADER
JP3 = pinhead:PINHD-1X4: PIN HEADER
JP4-JP7 = pinhead:PINHD-1X3: PIN HEADER
K3 = t32_ref:MK20DX256VLH7; DESC: MK20DX256VLH7; MF: NXP; MPN: MK20DX256VLH7; OC_MOUSER: 841-MK20DX256VLH7; PACKAGE: LQFP-64; TYPE: Microcontroller
LED1 = SamacSys_Parts:QBLP679E-RGB: LED RGB DIFFUSED 6PLCC SMD Source: Datasheet <http://www.qt-brightek.com/datasheet/QBLP679E-RGB.pdf>; ARROW_PART_NUMBER: QBLP679E-RGB; DESCRIPTION: LED RGB DIFFUSED 6PLCC SMD; HEIGHT: 1.8mm; MANUFACTURER_NAME: QT Brightek (QTB); MANUFACTURER_PART_NUMBER: QBLP679E-RGB
LS1 = SamacSys_Parts:CMT-1603-SMT-TR: AUDIO PIEZO TRANSDUCER 25V SMD Source: Datasheet <https://componentsearchengine.com/Datasheets/1/CMT-1603-SMT-TR.pdf>; ARROW_PART_NUMBER: CMT-1603-SMT-TR; ARROW_PRICE-STOCK: https://www.arrow.com/en/products/cmt-1603-smt-tr/cui-devices; DESCRIPTION: AUDIO PIEZO TRANSDUCER 25V SMD; HEIGHT: 2.8mm; MANUFACTURER_NAME: CUI Devices; MANUFACTURER_PART_NUMBER: CMT-1603-SMT-TR; MOUSER_PART_NUMBER: 490-CMT-1603-SMT-TR; MOUSER_PRICE-STOCK: https://www.mouser.co.uk/ProductDetail/CUI-Devices/CMT-1603-SMT-TR?qs=WyjlAZoYn50AZ4xT4ox6zw%3D%3D
LT1764#TRPBF = SamacSys_Parts:LT1764AEQ-3.3#TRPBF: LDO Voltage Regulators 3A, Fast Tran Resp, L N, LDO Regs Source: Datasheet <https://www.analog.com/media/en/technical-documentation/data-sheets/1764afb.pdf>; ARROW_PART_NUMBER: LT1764AEQ-3.3#TRPBF; DESCRIPTION: LDO Voltage Regulators 3A, Fast Tran Resp, L N, LDO Regs; HEIGHT: 4.572mm; MANUFACTURER_NAME: Linear Technology; MANUFACTURER_PART_NUMBER: LT1764AEQ-3.3#TRPBF; MOUSER_PART_NUMBER: 584-1764AEQ-3.3TRPBF; MOUSER_PRICE-STOCK: https://www.mouser.co.uk/ProductDetail/Analog-Devices-Linear-Technology/LT1764AEQ-33TRPBF?qs=ytflclh7QUVo8QnKetIRUw%3D%3D
Q1 Q2 Q5-Q7 = SamacSys_Parts:CSD17575Q3: 30V, N ch NexFET MOSFET, single SON3x3, 3.2mOhm Source: Datasheet <http://www.ti.com/lit/gpn/csd17575q3>; ARROW_PART_NUMBER: CSD17575Q3; ARROW_PRICE-STOCK: https://www.arrow.com/en/products/csd17575q3/texas-instruments; DESCRIPTION: 30V, N ch NexFET MOSFET, single SON3x3, 3.2mOhm; HEIGHT: mm; MANUFACTURER_NAME: Texas Instruments; MANUFACTURER_PART_NUMBER: CSD17575Q3; MOUSER_PART_NUMBER: 595-CSD17575Q3; MOUSER_PRICE-STOCK: https://www.mouser.co.uk/ProductDetail/Texas-Instruments/CSD17575Q3?qs=1MXlzafEN3%2FTIl0%2FpyGUYQ%3D%3D
Q8 = SparkFun-DiscreteSemi:MOSFET-NCH: N-channel MOSFETs Voltage controlled devices that allow control of high current outputs. SparkFun Products: SparkFun OpenScale <https://www.sparkfun.com/products/13261> SparkFun Digital Sandbox <https://www.sparkfun.com/products/12651> SparkFun Monster Moto Shield <https://www.sparkfun.com/products/10182> SparkFun MOSFET Power Controller <https://www.sparkfun.com/products/11214>; PROD_ID: TRANS-00830
R1-R3 R5-R12 R14-R18 R21-R27 R29-R54 R57-R68 = rcl:R-US_: RESISTOR, American symbol; SPICEPREFIX: R
R28 R55 R69 = SamacSys_Parts:PWR163S-25-2R20J: Thick Film Resistors - SMD 25watts 5% 2.2Ohm DPAK Source: Datasheet <https://www.bourns.com/docs/Product-Datasheets/PWR163.pdf>; ARROW_PART_NUMBER: PWR163S-25-2R20J; DESCRIPTION: Thick Film Resistors - SMD 25watts 5% 2.2Ohm DPAK; HEIGHT: mm; MANUFACTURER_NAME: Bourns; MANUFACTURER_PART_NUMBER: PWR163S-25-2R20J; MOUSER_PART_NUMBER: 652-PWR163S-25-2R20J; MOUSER_PRICE-STOCK: https://www.mouser.co.uk/ProductDetail/Bourns/PWR163S-25-2R20J?qs=Irp2sZejZDSl03BQqaIVVg%3D%3D
S2 S3 = SamacSys_Parts:PTS810SJG250SMTRLFS: PTS810SJG250SMTRLFS (Tactile Switches) Switch Tactile N.O. SPST Button J-Bend 0.05A 16VDC 100000Cycles 3.92N SMD T/R Source: Datasheet <https://www.ckswitches.com/media/1476/pts810.pdf>; ARROW_PART_NUMBER: PTS810SJG250SMTRLFS; DESCRIPTION: PTS810SJG250SMTRLFS (Tactile Switches) Switch Tactile N.O. SPST Button J-Bend 0.05A 16VDC 100000Cycles 3.92N SMD T/R; HEIGHT: 2.7mm; MANUFACTURER_NAME: C & K COMPONENTS; MANUFACTURER_PART_NUMBER: PTS810SJG250SMTRLFS; MOUSER_PART_NUMBER: 611-PTS810SJG250SMTR; MOUSER_PRICE-STOCK: https://www.mouser.co.uk/ProductDetail/CK/PTS810SJG250SMTRLFS?qs=UxeAxwACbqndUPIQjZosiw%3D%3D
S4 = SamacSys_Parts:JS202011JCQN: Slide Switch DPDT Surface Mount Source: Datasheet <https://www.ckswitches.com/media/1422/js.pdf>; ARROW_PART_NUMBER: JS202011JCQN; ARROW_PRICE-STOCK: https://www.arrow.com/en/products/js202011jcqn/ck; DESCRIPTION: Slide Switch DPDT Surface Mount; HEIGHT: 5mm; MANUFACTURER_NAME: C & K COMPONENTS; MANUFACTURER_PART_NUMBER: JS202011JCQN; MOUSER_PART_NUMBER: 611-JS202011JCQN; MOUSER_PRICE-STOCK: https://www.mouser.co.uk/ProductDetail/CK/JS202011JCQN?qs=74EMXstkWMXJzVJFnXPbEg%3D%3D
SJ1 = microbuilder:SOLDERJUMPER_2WAY: 2-Way Solder Jumper
U1 = RFM95W-868S2:RFM95W-868S2: Mod Txrx Lora +20dbm 868mhz Smd; AVAILABILITY: Unavailable; DESCRIPTION: General ISM < 1GHz LoRa™ Transceiver Module 868MHz Antenna Not Included Surface Mount; MF: RF; MP: RFM95W-868S2; PACKAGE: SMD-16 Hope Microelectronics; PRICE: None
U2 U6 = ADS1015IDGST:ADS1015IDGST; DESCRIPTION: 12-Bit, 3.3kSPS, 4-Ch Delta-Sigma ADC With PGA, Oscillator, VREF, Comparator and I2C Interface 10-VSSOP -40 to 125; DIGI-KEY_PART_NUMBER: 296-25227-1-ND; MF: Texas Instruments; MP: ADS1015IDGST; PACKAGE: VSSOP-10 Texas Instruments; TEXAS_INSTRUMENTS-PURCHASE-URL: https://snapeda.com/shop?store=Texas+Instruments&id=425936
U4 = SparkFun-GPS:U-BLOX_SAM_M8Q-0-10: u-blox SAM-M8Q The u-blox concurrent SAM-M8Q GNSS patch antenna module benefits from the exceptional performance of the u-blox M8 multi-GNSS engine. The SAM-M8Q module offers high sensitivity and minimal acquisition times in an ultra compact form factor. The SAM-M8Q module utilizes concurrent reception of up to three GNSS systems (GPS/Galileo and GLONASS), recognizes multiple constellations simultaneously and provides outstanding positioning accuracy in scenarios where urban canyon or weak signals are involved. For even better and faster positioning improvement, the SAM-M8Q supports augmentation of QZSS, GAGAN and IMES together with WAAS, EGNOS, MSAS. The SAM-M8Q also supports message integrity protection, geofencing, and spoofing detection with configurable interface settings to easily fit to customer applications.; PROD_ID: IC-14070
USBPOW = jumper:SJ: SMD solder JUMPER
Y2 = SamacSys_Parts:ABS10-32.768KHZ-9-T: ABRACON - ABS10-32.768KHZ-9-T - Crystal, 32.768 kHz, SMD, 4.9mm x 1.8mm, 9 pF, 20 ppm, ABS10 Series Source: Datasheet <https://abracon.com/Resonators/ABS10.pdf>; ARROW_PART_NUMBER: ABS10-32.768KHZ-9-T; ARROW_PRICE-STOCK: https://www.arrow.com/en/products/abs10-32.768khz-9-t/abracon; DESCRIPTION: ABRACON - ABS10-32.768KHZ-9-T - Crystal, 32.768 kHz, SMD, 4.9mm x 1.8mm, 9 pF, 20 ppm, ABS10 Series; HEIGHT: mm; MANUFACTURER_NAME: ABRACON; MANUFACTURER_PART_NUMBER: ABS10-32.768KHZ-9-T; MOUSER_PART_NUMBER: 815-ABS10-32.768K9T; MOUSER_PRICE-STOCK: https://www.mouser.co.uk/ProductDetail/ABRACON/ABS10-32768KHZ-9-T?qs=76dmnhCH%2FMO8FcjiLkcQ2w%3D%3D
Z2 = SamacSys_Parts:1SMB5929BT3G: ON Semiconductor, 15V Zener Diode 5% 550 mW SMT 2-Pin SMB Source: Datasheet <https://www.onsemi.com/pub/Collateral/1SMB5913BT3-D.PDF>; ARROW_PART_NUMBER: 1SMB5929BT3G; ARROW_PRICE-STOCK: https://www.arrow.com/en/products/1smb5929bt3g/on-semiconductor; DESCRIPTION: ON Semiconductor, 15V Zener Diode 5% 550 mW SMT 2-Pin SMB; HEIGHT: 2.47mm; MANUFACTURER_NAME: ON Semiconductor; MANUFACTURER_PART_NUMBER: 1SMB5929BT3G; MOUSER_PART_NUMBER: 863-1SMB5929BT3G; MOUSER_PRICE-STOCK: https://www.mouser.co.uk/ProductDetail/ON-Semiconductor/1SMB5929BT3G?qs=vLkC5FC1VN%2FFUr7OS2Q1Aw%3D%3D

## Net classes
0 default: width 0.127 mm